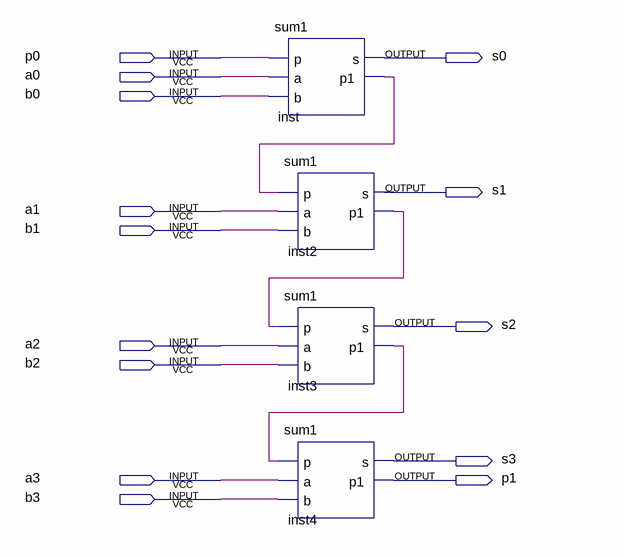
[diagram p0: schematic sheet]
// Quartus schematic sum4.bdf as structural Verilog: 4 symbols, 14 pins
module sum4 (
  input  p0,
  input  a0,
  input  b0,
  input  a1,
  input  b1,
  input  a2,
  input  b2,
  input  a3,
  input  b3,
  output s0,
  output s1,
  output s2,
  output s3,
  output p1
);

  wire inst2_p1, inst3_p1, inst_p1;

  sum1 inst (.p(p0), .a(a0), .b(b0), .s(s0), .p1(inst_p1));
  sum1 inst2 (.p(inst_p1), .a(a1), .b(b1), .s(s1), .p1(inst2_p1));
  sum1 inst3 (.p(inst2_p1), .a(a2), .b(b2), .s(s2), .p1(inst3_p1));
  sum1 inst4 (.p(inst3_p1), .a(a3), .b(b3), .s(s3), .p1(p1));
endmodule
